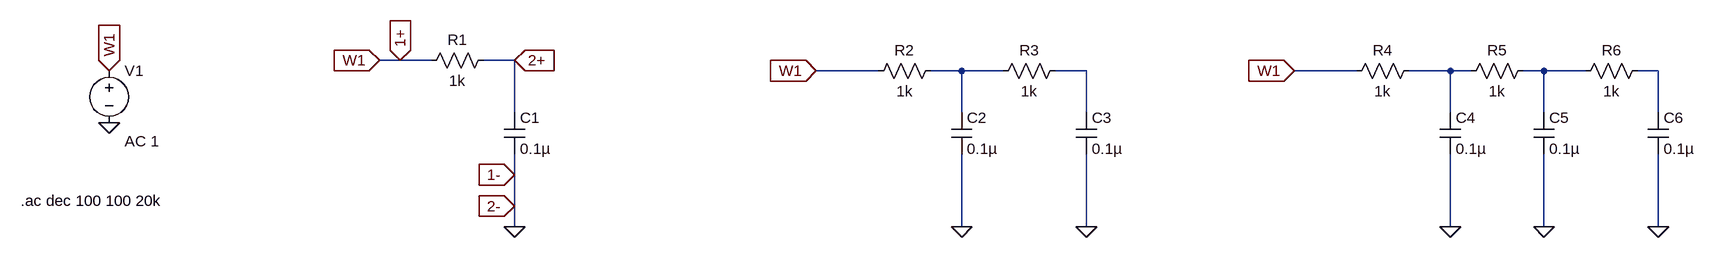
[diagram p0: schematic 1st_2nd_3rd_order_filters.asc]
1st_2nd_3rd_order_filters.asc, the LTspice schematic file:
Version 4
SHEET 1 2060 680
WIRE 32 64 0 64
WIRE 80 64 32 64
WIRE 208 64 160 64
WIRE 768 80 672 80
WIRE 896 80 848 80
WIRE 960 80 896 80
WIRE 1088 80 1040 80
WIRE 1504 80 1408 80
WIRE 1648 80 1584 80
WIRE 1680 80 1648 80
WIRE 1792 80 1760 80
WIRE 1856 80 1792 80
WIRE 1968 80 1936 80
WIRE 208 144 208 64
WIRE 896 144 896 80
WIRE 1088 144 1088 80
WIRE 1648 144 1648 80
WIRE 1792 144 1792 80
WIRE 1968 144 1968 80
WIRE 208 240 208 208
WIRE 208 288 208 240
WIRE 1968 320 1968 208
WIRE 208 320 208 288
WIRE 896 320 896 208
WIRE 1088 320 1088 208
WIRE 1648 320 1648 208
WIRE 1792 320 1792 208
FLAG -416 160 0
FLAG -416 80 W1
IOPIN -416 80 In
FLAG 208 320 0
FLAG 896 320 0
FLAG 1088 320 0
FLAG 1648 320 0
FLAG 1792 320 0
FLAG 1968 320 0
FLAG 0 64 W1
IOPIN 0 64 In
FLAG 672 80 W1
IOPIN 672 80 In
FLAG 1408 80 W1
IOPIN 1408 80 In
FLAG 32 64 1+
IOPIN 32 64 In
FLAG 208 64 2+
IOPIN 208 64 In
FLAG 208 240 1-
IOPIN 208 240 In
FLAG 208 288 2-
IOPIN 208 288 In
SYMBOL voltage -416 64 R0
WINDOW 123 24 124 Left 2
WINDOW 39 0 0 Left 0
SYMATTR InstName V1
SYMATTR Value ""
SYMATTR Value2 AC 1
SYMBOL res 176 48 R90
WINDOW 0 0 56 VBottom 2
WINDOW 3 32 56 VTop 2
SYMATTR InstName R1
SYMATTR Value 1k
SYMBOL res 864 64 R90
WINDOW 0 0 56 VBottom 2
WINDOW 3 32 56 VTop 2
SYMATTR InstName R2
SYMATTR Value 1k
SYMBOL res 1056 64 R90
WINDOW 0 0 56 VBottom 2
WINDOW 3 32 56 VTop 2
SYMATTR InstName R3
SYMATTR Value 1k
SYMBOL res 1600 64 R90
WINDOW 0 0 56 VBottom 2
WINDOW 3 32 56 VTop 2
SYMATTR InstName R4
SYMATTR Value 1k
SYMBOL res 1776 64 R90
WINDOW 0 0 56 VBottom 2
WINDOW 3 32 56 VTop 2
SYMATTR InstName R5
SYMATTR Value 1k
SYMBOL res 1952 64 R90
WINDOW 0 0 56 VBottom 2
WINDOW 3 32 56 VTop 2
SYMATTR InstName R6
SYMATTR Value 1k
SYMBOL cap 192 144 R0
SYMATTR InstName C1
SYMATTR Value 0.1µ
SYMBOL cap 880 144 R0
SYMATTR InstName C2
SYMATTR Value 0.1µ
SYMBOL cap 1072 144 R0
SYMATTR InstName C3
SYMATTR Value 0.1µ
SYMBOL cap 1632 144 R0
SYMATTR InstName C4
SYMATTR Value 0.1µ
SYMBOL cap 1776 144 R0
SYMATTR InstName C5
SYMATTR Value 0.1µ
SYMBOL cap 1952 144 R0
SYMATTR InstName C6
SYMATTR Value 0.1µ
TEXT -552 280 Left 2 !.ac dec 100 100 20k

The netlist it stands for:
* 1st_2nd_3rd_order_filters.asc
V1 1+ 0 AC 1
R1 2+ 1+ 1k
R2 N001 1+ 1k
R3 N002 N001 1k
R4 N003 1+ 1k
R5 N004 N003 1k
R6 N005 N004 1k
C1 2+ 0 0.1µ
C2 N001 0 0.1µ
C3 N002 0 0.1µ
C4 N003 0 0.1µ
C5 N004 0 0.1µ
C6 N005 0 0.1µ
.ac dec 100 100 20k
.backanno
.end